# Altium schematic sheet Programming Header.SchDoc: STM32 MCU Programming Header
size Letter; DrawnBy: Lance Bantoto; DocumentNumber: 1; SheetNumber: 1; SheetTotal: 1
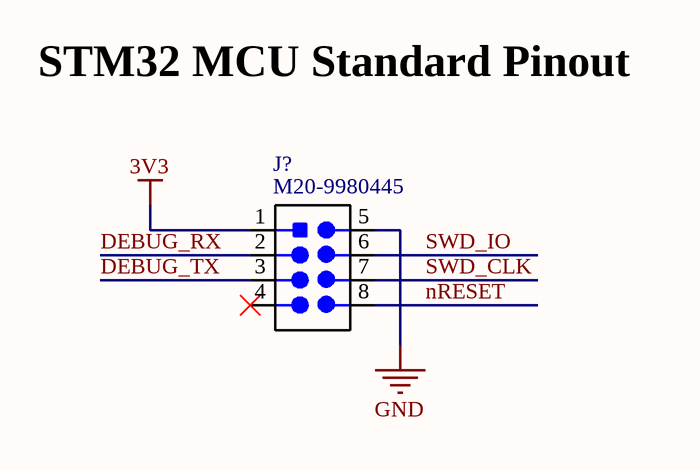
[diagram p0: Programming Header.SchDoc]

## Parts
J?  Manufacturer Part Number 1: M20-9980445  [HEADER_2X4]  (hidden comment: HEADER 4X2)

## Nets
3V3: J?.1(VCC)
GND: J?.5(GND)
DEBUG_RX: J?.2
DEBUG_TX: J?.3
nRESET: J?.8
SWD_CLK: J?.7
SWD_IO: J?.6

Not connected (* = marked no-connect by the designer): J? 4*

## Notes on the sheet
- STM32 MCU Standard Pinout
- Title
- Size:
- Date:
- Letter
- Drawn By:
- Sheet
- of
- File:

## Library data of the parts
J? = HEADER 4X2: CONN HEADER VERT 8POS 2.54MM; Manufacturer 1: Harwin Inc.; Supplier Part Number 1: 952-2122-ND; Supplier 1: Digi-Key; Mount: Through Hole